# Altium schematic sheet PowerToDes_D34.SchDoc
size 381 x 241 mm; SheetNumber: 4; SheetTotal: 4
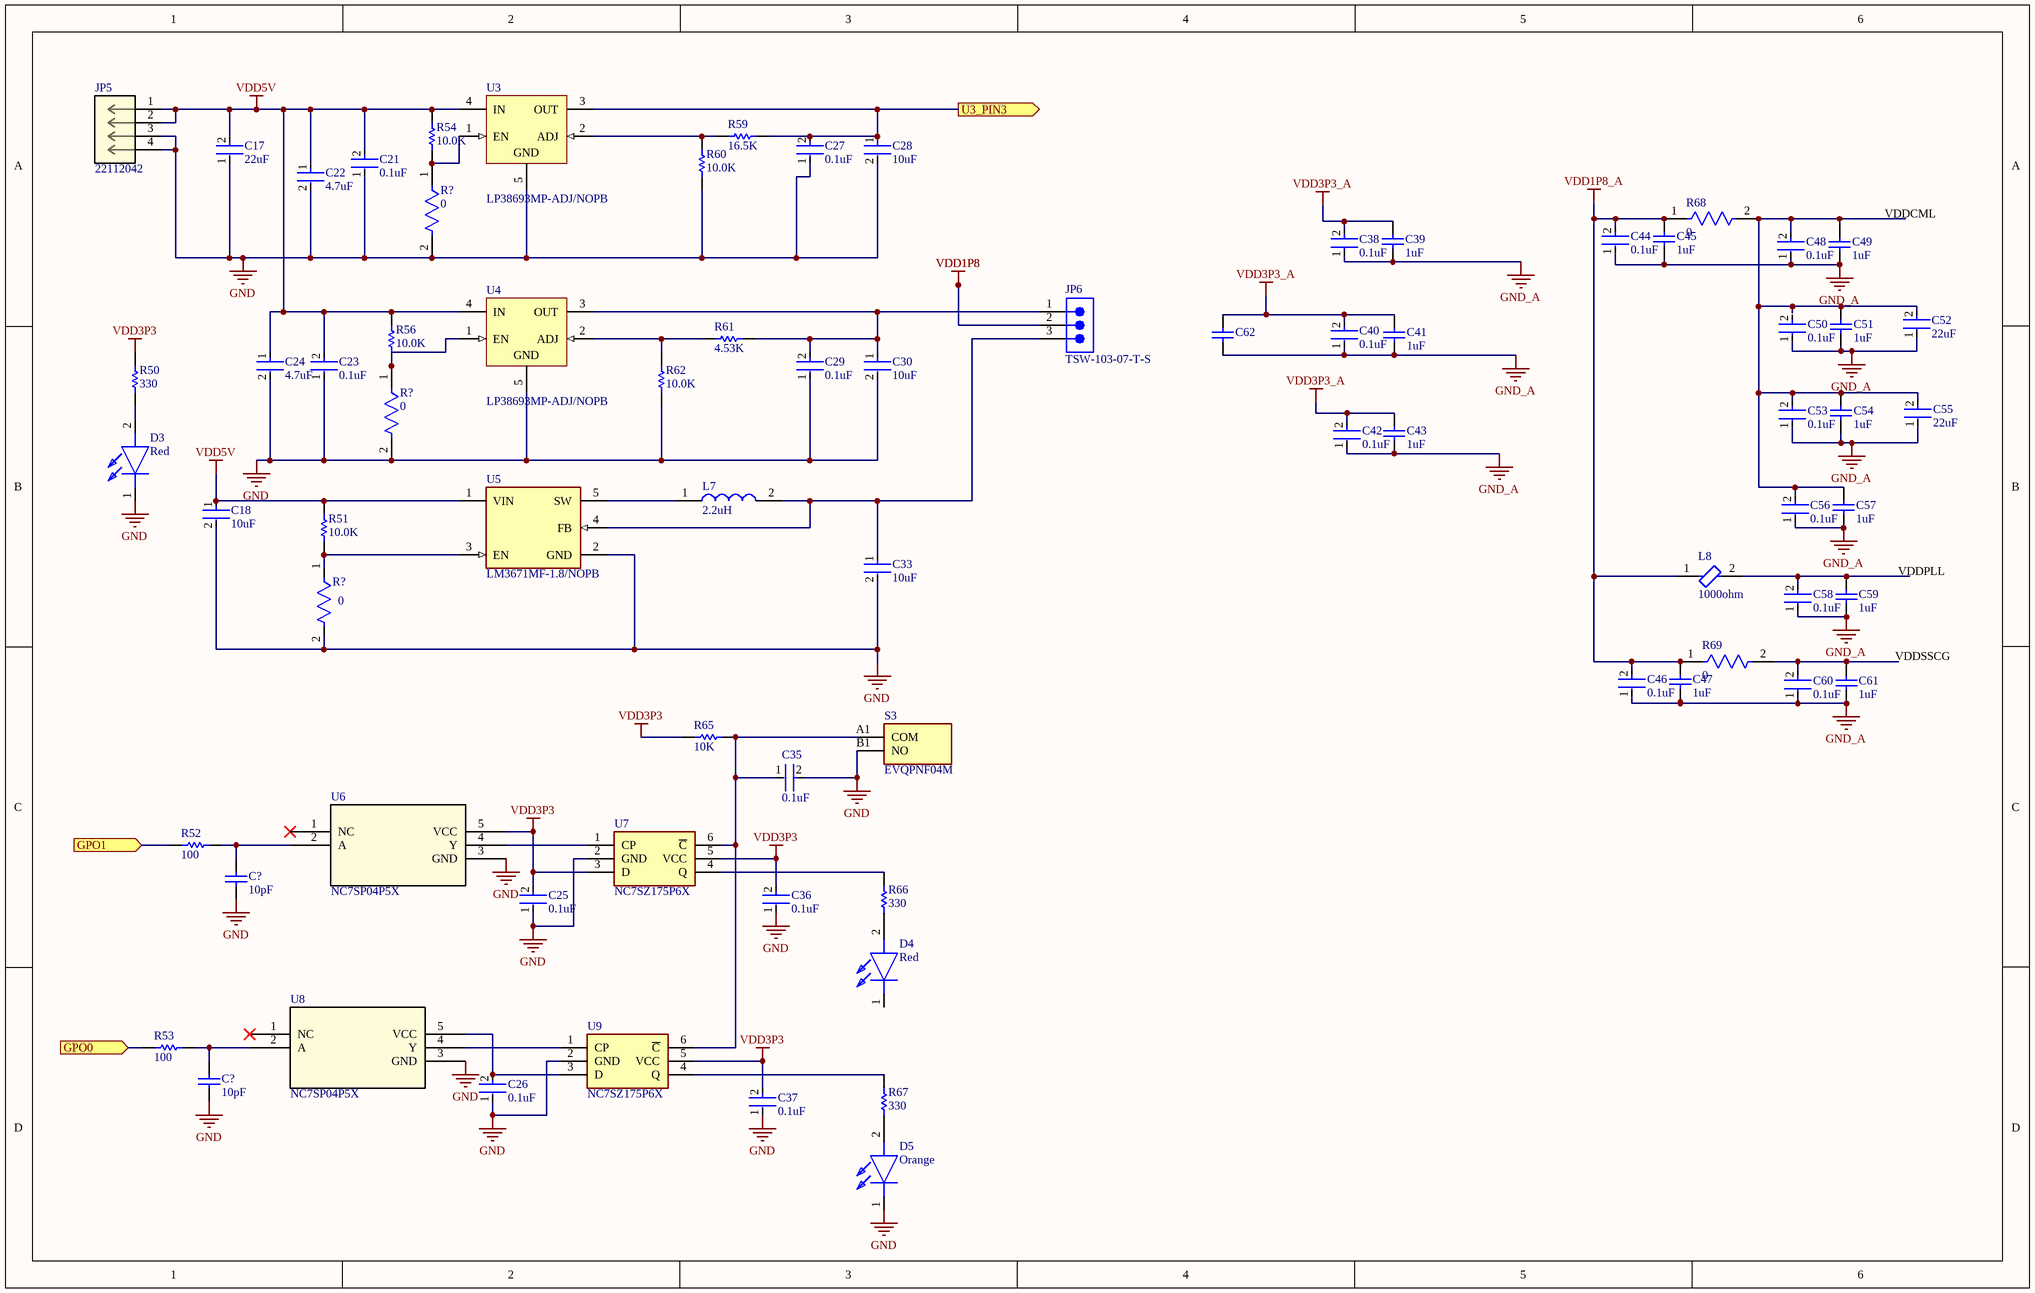
[diagram p0: PowerToDes_D34.SchDoc]

## Parts
(Parts that share a designator on the sheet are numbered #1, #2 ... from top to bottom, then left to right.)
C17  22uF  [FP-GCM32E-0_3-IPC_B]
C18  10uF  [FP-GRM21B-0_1-IPC_C]
C21  0.1uF  [FP-GRM15-MFG]
C22  4.7uF  [FP-GRM21B-0_15-MFG]
C23  0.1uF  [FP-GRM15-MFG]
C24  4.7uF  [FP-GRM21B-0_15-MFG]
C25  0.1uF  [FP-GRM15-MFG]
C26  0.1uF  [FP-GRM15-MFG]
C27  0.1uF  [FP-GRM15-MFG]
C28  10uF  [FP-GRM21B-0_1-IPC_C]
C29  0.1uF  [FP-GRM15-MFG]
C30  10uF  [FP-GRM21B-0_1-IPC_C]
C33  10uF  [FP-GRM21B-0_1-IPC_C]
C35  0.1uF  [FP-GRM15-MFG]
C36  0.1uF  [FP-GRM15-MFG]
C37  0.1uF  [FP-GRM15-MFG]
C38  0.1uF  [FP-GRM15-MFG]
C39  1uF  [CAPC1608X90X35ML10T15]
C40  0.1uF  [FP-GRM15-MFG]
C41  1uF  [CAPC1608X90X35ML10T15]
C42  0.1uF  [FP-GRM15-MFG]
C43  1uF  [CAPC1608X90X35ML10T15]
C44  0.1uF  [FP-GRM15-MFG]
C45  1uF  [CAPC1608X90X35ML10T15]
C46  0.1uF  [FP-GRM15-MFG]
C47  1uF  [CAPC1608X90X35ML10T15]
C48  0.1uF  [FP-GRM15-MFG]
C49  1uF  [CAPC1608X90X35ML10T15]
C50  0.1uF  [FP-GRM15-MFG]
C51  1uF  [CAPC1608X90X35ML10T15]
C52  22uF  [FP-GCM32E-0_3-IPC_B]
C53  0.1uF  [FP-GRM15-MFG]
C54  1uF  [CAPC1608X90X35ML10T15]
C55  22uF  [FP-GCM32E-0_3-IPC_B]
C56  0.1uF  [FP-GRM15-MFG]
C57  1uF  [CAPC1608X90X35ML10T15]
C58  0.1uF  [FP-GRM15-MFG]
C59  1uF  [CAPC1608X90X35ML10T15]
C60  0.1uF  [FP-GRM15-MFG]
C61  1uF  [CAPC1608X90X35ML10T15]
C62  (no value)  [CAPC2013X140X45NL15T25]
C?#1  10pF  [CAPC1005X55X25LL05T10]
C?#2  10pF  [CAPC1005X55X25LL05T10]
D3  Red  [LEDC1608X55N]
D4  Red  [LEDC1608X55N]
D5  Orange  [LEDC1608X55N]
JP5  22112042  [CONN_A-6373-04A_MOL]
JP6  TSW-103-07-T-S  [SMTC-TSW-103-07-X-S]
L7  2.2uH  [LPS3015]
L8  1000ohm  [FP-BLM18-0_15-t0_8-MFG]
R50  330  [RESC1005X40X25ML05T05]
R51  10.0K  [RESC1609X55X30LL15T15]
R52  100  [RESC1005X40X25LL05T05]
R53  100  [RESC1005X40X25LL05T05]
R54  10.0K  [RESC1609X55X30LL15T15]
R56  10.0K  [RESC1609X55X30LL15T15]
R59  16.5K  [RESC1608X55X30LL15T15]
R60  10.0K  [RESC1609X55X30LL15T15]
R61  4.53K  [RESC1608X55X30ML15T15]
R62  10.0K  [RESC1609X55X30LL15T15]
R65  10K  [RESC1005X40X25ML05T05]
R66  330  [RESC1005X40X25ML05T05]
R67  330  [RESC1005X40X25ML05T05]
R68  0  [FP-ERJ-3GEY0R00V-MFG]
R69  0  [FP-ERJ-3GEY0R00V-MFG]
R?#1  0  [FP-ERJ-3GEY0R00V-MFG]
R?#2  0  [FP-ERJ-3GEY0R00V-MFG]
R?#3  0  [FP-ERJ-3GEY0R00V-MFG]
S3  EVQPNF04M  [EVQ5PN05K]
U3  LP38693MP-ADJ/NOPB  [NDC0005A_N]
U4  LP38693MP-ADJ/NOPB  [NDC0005A_N]
U5  LM3671MF-1.8/NOPB  [FP-DBV0005A-IPC_A]
U6  NC7SP04P5X  [SC-88A-5_1P35X2P2_ONS]
U7  NC7SZ175P6X  [SOT65P210X110-6N]
U8  NC7SP04P5X  [SC-88A-5_1P35X2P2_ONS]
U9  NC7SZ175P6X  [SOT65P210X110-6N]

## Ports
GPO0 (in, see PowerToSer[2C]), GPO1 (in, see PowerToSer[3B]), U3_PIN3 (out, see BuckRegulatorOnSer[5C], PowerToSer[2A])

## Nets
GND: C17.1 C18.2 C21.1 C22.2 C23.1 C24.2 C25.1 C26.1 C27.1 C28.2 C29.1 C30.2 C33.2 C35.2 C36.1 C37.1 C?#1.2 C?#2.2 D3.1(K) D5.1(K) JP5.3 JP5.4 R60.2 R62.2 R?#1.2 R?#2.2 R?#3.2 S3.B1(NO) U3.5(GND) U4.5(GND) U5.2(GND) U6.3(GND) U7.2(GND) U8.3(GND) U9.2(GND)
GND_A: C38.1 C39.2 C40.1 C41.2 C42.1 C43.2 C44.1 C45.2 C46.1 C47.2 C48.1 C49.2 C50.1 C51.2 C52.1 C53.1 C54.2 C55.1 C56.1 C57.2 C58.1 C59.2 C60.1 C61.2 C62.2
VDD1P8: JP6.2
VDD1P8_A: C44.2 C45.1 C46.2 C47.1 L8.1 R68.1 R69.1
VDD3P3: C25.2 C36.2 C37.2 R50.1 R65.1 U6.5(VCC) U7.3(D) U7.5(VCC) U9.5(VCC)
VDD3P3_A: C38.2 C39.1 C40.2 C41.1 C42.2 C43.1 C62.1
VDD5V: C17.2 C18.1 C21.2 C22.1 C23.2 C24.1 JP5.1 JP5.2 R51.1 R54.1 R56.1 U3.4(IN) U4.4(IN) U5.1(VIN)
GPO0: R53.1 ; port GPO0
GPO1: R52.1 ; port GPO1
U3_PIN3: C27.2 C28.1 R59.2 U3.3(OUT) ; port U3_PIN3
NetC26_2: C26.2 U8.5(VCC) U9.3(D)
NetC29_2: C29.2 C30.1 JP6.1 R61.2 U4.3(OUT)
NetC33_1: C33.1 JP6.3 L7.2 U5.4(FB)
NetC35_1: C35.1 R65.2 S3.A1(COM) U7.6(~{C}) U9.6(~{C})
NetC48_2: C48.2 C49.1 C51.1 C52.2 C53.2 C54.1 C55.2 C56.2 C57.1 R68.2
NetC58_2: C58.2 C59.1 L8.2
NetC60_2: C60.2 C61.1 R69.2
NetC?#1_1: C?#1.1 R52.2 U6.2(A)
NetC?#2_1: C?#2.1 R53.2 U8.2(A)
NetD3_2: D3.2(A) R50.2
NetD4_2: D4.2(A) R66.2
NetD5_2: D5.2(A) R67.2
NetL7_1: L7.1 U5.5(SW)
NetR51_2: R51.2 R?#3.1 U5.3(EN)
NetR54_2: R54.2 R?#1.1 U3.1(EN)
NetR56_2: R56.2 R?#2.1 U4.1(EN)
NetR59_1: R59.1 R60.1 U3.2(ADJ)
NetR61_1: R61.1 R62.1 U4.2(ADJ)
NetR66_1: R66.1 U7.4(Q)
NetR67_1: R67.1 U9.4(Q)
NetU6_4: U6.4(Y) U7.1(CP)
NetU8_4: U8.4(Y) U9.1(CP)

Not connected (* = marked no-connect by the designer): C50 2; D4 1(K); U6 1(NC)*; U8 1(NC)*

## Notes on the sheet
- (near C49) VDDCML
- VDDPLL
- VDDSSCG

## Library data of the parts
C17 C52 C55 = CMP-06035-049658-1: Ceramic Capacitor for Automotive 22uF ±10% 16VDC X7R 1210 Embossed T/R; Voltage Rating: 16V; Max Operating Temperature: 125°C; Case/Package: 1210; Packaging: Tape and Reel; Termination: SMD/SMT; Height: 2.5mm; Voltage Rating (DC): 16V; Length: 3.2mm; Width: 0.098inch; Voltage: 16V; Depth: 2.5mm; Package Quantity: 1; Mount: Surface Mount; Min Operating Temperature: -55°C; Case Code (Metric): 3225; Case Code (Imperial): 1210; Radiation Hardening: No; Thickness: 0.106inch; Ratings: AEC-Q200; Capacitance: 22uF; Tolerance: 10%; Dielectric: X7R; Lead Free: Lead Free
C18 C28 C30 C33 = CMP-2007-03453-2: Chip Multilayer Ceramic Capacitors for General Purpose, 0805, 10uF, X5R, 15%, 10%, 16V; Radiation Hardening: No; Thickness: 0.053inch; Voltage Rating (DC): 16V; Lead Free: Lead Free; Package Quantity: 1; Width: 1.25mm; Case Code (Imperial): 0805; Depth: 1.25mm; Packaging: Tape and Reel; Dielectric: X5R; Max Operating Temperature: 85°C; Tolerance: 10%; Voltage Rating: 16V; Voltage: 16V; Capacitance: 10uF; Height: 1.25mm; Case Code (Metric): 2012; Material: Ceramic; Mount: Surface Mount; Case/Package: 0805; REACH SVHC: No SVHC; Length: 2mm; Min Operating Temperature: -55°C; Termination: SMD/SMT
C21 C23 C27 C29 = CMP-2100-03641-2: CAP CER 0.1UF 16V X7R 0402; Manufacturer Part Number: GRM155R71C104KA88D; Manufacturer: Murata; Standoff Height: 0mm; Tolerance: 10%; Voltage Rating: 16Vdc; Material: Ceramic; Capacitance: 0.10μF; Value: 0.10μF; RoHS: TRUE; Temperature Characteristic: X7R; Octopart: https://octopart.com/grm155r71c104ka88d-murata-196880; Digikey Description: CAP CER 0.1UF 16V X7R 0402; Device Class L3: Ceramic Capacitors; Height: 0.55mm; ComponentLink2Description: Datasheet; Temperature Range Low: -55°C; Ipc Land Pattern Name: CAPC10050X219; ComponentLink2URL: https://search.murata.co.jp/Ceramy/image/img/A01X/G101/ENG/GRM155R71H471KA01-01A.pdf; Device Class L1: Passive Components; Lead Free: yes; Category: Cap; Package: GRM15; Temperature: -55°C to +125°C; Device Class L2: Capacitors; Temperature Range High: +125°C; Mouser Description: 0402 0.1 uF 16V ±10 % Tolerance X7R SMT Multilayer Ceramic Capacitor
C22 C24 = CMP-2007-03401-2: CAP CER 4.7UF 16V X7R 0805; Material: Ceramic; Tolerance: 10%; Case Code (Metric): 2012; Voltage Rating: 16V; RoHS Compliant: Yes; Voltage Rating (DC): 16V; Case/Package: 0805; Number of Pins: 2; Thickness: 0.053inch; Voltage: 16V; Mount: Surface Mount; Packaging: Tape and Reel; Lead Free: Lead Free; Case Code (Imperial): 0805; Series: GRM; Width: 0.049inch; Package Quantity: 1; Construction: Flat; Min Operating Temperature: -55°C; Termination: SMD/SMT; Max Operating Temperature: 125°C; Length: 2mm; Dielectric: X7R; Depth: 1.25mm; REACH SVHC: No SVHC; Height: 1.25mm; Capacitance: 4.7uF
C25 C26 C35-C38 C40 C42 C44 C46 C48 C50 C53 C56 C58 C60 = CMP-2100-03641-2: CAP CER 0.1UF 16V X7R 0402; Manufacturer Part Number: GRM155R71C104KA88D; Manufacturer: Murata; Standoff Height: 0mm; Tolerance: 10%; Description: CAP Ceramic 0.10μF 10% X7R 16Vdc 0402 SMD; Voltage Rating: 16Vdc; Material: Ceramic; Capacitance: 0.10μF; Value: 0.10μF; RoHS: TRUE; Temperature Characteristic: X7R; Octopart: https://octopart.com/grm155r71c104ka88d-murata-196880; Digikey Description: CAP CER 0.1UF 16V X7R 0402; Device Class L3: Ceramic Capacitors; Height: 0.55mm; ComponentLink2Description: Datasheet; Temperature Range Low: -55°C; Ipc Land Pattern Name: CAPC10050X219; ComponentLink2URL: https://search.murata.co.jp/Ceramy/image/img/A01X/G101/ENG/GRM155R71H471KA01-01A.pdf; Device Class L1: Passive Components; Lead Free: yes; Category: Cap; Package: GRM15; Temperature: -55°C to +125°C; Device Class L2: Capacitors; Temperature Range High: +125°C; Mouser Description: 0402 0.1 uF 16V ±10 % Tolerance X7R SMT Multilayer Ceramic Capacitor
C39 C41 C43 C45 C47 C49 C51 C54 C57 C59 C61 = CMP-2006-02460-1: Manufacturer: Murata; Part Number: GRM188R71E105KA12D
C62 = CMP-2007-03395-1: Part Number: GRM21BR71A106KE51L; Manufacturer: Murata
C?#1 C?#2 = CMP-2008-04245-1: Part Number: GRM1555C1H100JA01D; Manufacturer: Murata
D3 D4 = LTST-C191KRKT: LED; Manufacturer_Name: Lite-On; Datasheet Link: http://www.mouser.com/ds/2/239/S_110_LTST-C191KRKT-539838.pdf; Height: 0.55mm; Manufacturer_Part_Number: LTST-C191KRKT; Mouser Part Number: 859-LTST-C191KRKT; Mouser Price/Stock: https://www.mouser.co.uk/ProductDetail/LITEON/LTST-C191KRKT?qs=BAIUz4Y8PJBLfOhzue0q%252BA%3D%3D; Arrow Part Number: LTST-C191KRKT; Arrow Price/Stock: https://www.arrow.com/en/products/ltst-c191krkt/lite-on-technology?utm_currency=USD&region=nac
D5 = LTST-C191KFKT: LED; Manufacturer_Name: Lite-On; Datasheet Link: https://datasheet.datasheetarchive.com/originals/distributors/Datasheets-305/79307.pdf; Height: 0.55mm; Manufacturer_Part_Number: LTST-C191KFKT; Mouser Part Number: 859-LTST-C191KFKT; Mouser Price/Stock: https://www.mouser.co.uk/ProductDetail/Lite-On/LTST-C191KFKT?qs=1bx9pL%2Fk%252BiAv01YAc0eitQ%3D%3D; Arrow Part Number: LTST-C191KFKT; Arrow Price/Stock: https://www.arrow.com/en/products/ltst-c191kfkt/lite-on-technology?utm_currency=USD&region=europe
JP5 = 22112042: KK 254 Solid Header, Vertical, with Friction Lock, 4 Circuits, Gold (Au)  Plating, Bag; Manufacturer_Name: Molex Connector Corporation; Copyright: Copyright (C) 2025 Ultra Librarian. All rights reserved.; Manufacturer_Part_Number: 22112042; RefDes: RefDes; Type: Type
JP6 = CMP-1024-00332-1: 0.025" SQ Post Header, Through-hole, Vertical, -55 to 105 degC, 2.54 mm Pitch, 3-Pin, Male, RoHS; Manufacturer: Samtec; Pitch: 2.54 mm; ComponentLink1URL: http://www.samtec.com; ComponentLink3URL: http://www.samtec.com/documents/webfiles/cpdf/TSW-XXX-XX-XXX-X-XX-XXX-MKT.pdf; PartNumber: TSW-103-07-T-S; Mounting Technology: Through-hole; RoHS: True; DatasheetVersion: F-214; PackageVersion: DM, 8/1988; Temperature Range: -55 to 105 degC; ComponentLink2Description: Datasheet; ComponentLink1Description: Manufacturer URL; Orientation: Vertical; PackageReference: TSW-103-07-X-S; ComponentLink3Description: Package Specification; ComponentLink2URL: http://www.samtec.com/documents/webfiles/pdf/TSW_TH.PDF; PackageDescription: .025[0.64] SQ. Post Terminal Strip Assembly
L7 = LPS3015-222MLB: Inductor; Manufacturer_Name: COILCRAFT; Datasheet Link: https://www.mouser.de/datasheet/2/597/lps3015-270734.pdf; Manufacturer_Part_Number: LPS3015-222MLB; Mouser Part Number: 994-LPS3015-222MLB; Mouser Price/Stock: https://www.mouser.co.uk/ProductDetail/Coilcraft/LPS3015-222MLB?qs=zCSbvcPd3pZ6eDikEPAG6g%3D%3D
L8 = CMP-0686-00457-3: Chip Ferrite Bead, 0603, 1000Ω @ 100MHz, 0.5Ω, 25%, 450mA; Number of Circuits: 1; Max DC Current: 400mA; Shielding: Unshielded; DC Resistance (DCR): 500mR; Material: Steel; DC Resistance-Max: 700mR; Impedance: 1kR; Case Code (Imperial): 0603; Max Current Rating: 400mA; Frequency: 100MHz; Min Operating Temperature: -55°C; Case/Package: 0603; Depth: 0.8mm; Lead Free: Lead Free; Core Material: Ferrite; Current Rating: 400mA; Resistance: 500mR; Case Code (Metric): 1608; DC Current: 400mA; Package Quantity: 1; Packaging: Tape and Reel; Width: 0.8mm; Military Standard: Not; Height: 0.8mm; Series: BLM18A; Max Operating Temperature: 125°C; Tolerance: 25%; Termination: SMD/SMT; Test Frequency: 100MHz; Number of Lines: 1; Number of Pins: 2; REACH SVHC: No SVHC; Length: 1.6mm; Radiation Hardening: No
R50 R66 R67 = CMP-2002-01143-1: Manufacturer: Panasonic; Part Number: ERJ2RKF3300X
R51 R54 R56 R60 R62 = CMP-1012-00623-3: Chip Resistor, 10 KOhm, +/- 1%, 0.1 W, -55 to 155 degC, 0603 (1608 Metric), RoHS, Tape and Reel; Manufacturer: Panasonic; Voltage Rating: 75V; Case\/Package: 0603; Power Rating: 100mW; Resistance: 10KOhm; Temperature Coefficient: 100ppm\/degreesC; Number of Pins: 2; Package Reference: 603; Depth: 0.8mm; Mount: SurfaceMount; Package Description: 2-Pin Surface Mount Device, Body 1.6 x 0.85 mm; Datasheet Version: 02/2017; Length: 1.6mm; Lead Free: LeadFree; Height: 0.45mm; Number of Terminations: 2; Max Power Dissipation: 100mW; Min Operating Temperature: -55degC; Datasheet URL: https://industrial.panasonic.com/cdbs/www-data/pdf/RDA0000/AOA0000C304.pdf; Termination: SMD/SMT; Case Code (Metric): 1608; Case Code (Imperial): 0603; Tolerance: 1%; Max Operating Temperature: 155degC; RoHSCompliant: true; Voltage Rating (DC): 75V; Radiation Hardening: No; Packaging: TapeandReel; Composition: ThickFilm; Mounting Technology: SurfaceMount; Manufacturer URL: http://www.panasonic.com/; Width: 0.031inch; REACH SVHC: NoSVHC; Contact Plating: Tin; Military Standard: Not; Package Quantity: 1
R52 R53 = CMP-2002-00605-3: Chip Resistor, 100 Ohm, +/- 1%, 100 mW, -55 to 155 degC, 0402 (1005 Metric), RoHS, Tape and Reel; Manufacturer: Basic Passives; PartNumber: ERJ-2RKF1000X; Power Rating: 100 mW; Resistance: 100 Ohm; Voltage Rating: 50 V; Case\/Package: 0402; Width: 0.5 mm; Pins: 2; ComponentLink2Description: Datasheet; PackageReference: 0402; Height: 0.35 mm; Tolerance: 1%; DatasheetVersion: 04/2015; Case Code (Imperial): 0402; Min Operating Temperature: -55 degC; Radiation Hardening: No; Length: 1 mm; Package Quantity: 10000; PackageDescription: 2-Pin Surface Mount Device, Body 1 x 0.5 mm; Mounting Technology: Surface Mount; Case Code (Metric): 1005; Packaging: Tape and Reel; ComponentLink1URL: http://www.panasonic.com/; RoHSCompliant: true; Max Operating Temperature: 155 degC; REACH SVHC: Yes; ComponentLink1Description: Manufacturer URL; ComponentLink2URL: http://industrial.panasonic.com/cdbs/www-data/pdf/RDA0000/AOA0000C86.pdf; Mount: Surface Mount
R59 = CMP-2000-00279-1: Manufacturer: Panasonic; Part Number: ERJ-3EKF1652V
R61 = CMP-2000-00512-1: Part Number: ERJ-3EKF4531V; Manufacturer: Panasonic
R65 = CMP-2002-00433-1: Part Number: ERJ-2GEJ103X; Manufacturer: Panasonic
R68 R69 = CMP-2000-00700-2: RES SMD 0 OHM JUMPER 1/10W 0603; Manufacturer Part Number: ERJ-3GEY0R00V; Manufacturer: Panasonic; Tolerance: 5%; Description: 0 Ohms Jumper 0.1W, 1/10W Chip Resistor 0603 (1608 Metric) Automotive AEC-Q200 Thick Film; Automotive Grade: Grade 0; Voltage Rating: 75V; Value: 0Ω; Temperature Coefficient: -100/+600ppm/°C; Power Rating: 0.1W; Mouser Description: Resistor, Chip Thick Film, 0 Ohm, 0.1w, Resistor, Chip Thick Film, 0 Ohm, 0.1w, 5%; Ipc Land Pattern Name: RESC16080X45; Category: Res; Package: 0603; Temperature: -55°C to +155°C; Temperature Range Low: -55°C; Series: ERJ; Resistance: 0Ω; RoHS: TRUE; Composition: Thick Film; Octopart: https://octopart.com/erj-3gey0r00v-panasonic-55389238; Device Class L1: Passive Components; Footprint Url: https://industrial.panasonic.com/cdbs/www-data/pdf/RDA0000/DMA0000COL17.pdf; ComponentLink2Description: Datasheet; Device Class L2: Resistors; Temperature Range High: +155°C; Digikey Description: RES SMD 0 OHM JUMPER 1/10W 0603; Lead Free: Yes; Device Class L3: Chip SMD Resistors; Height: 0.55mm; ComponentLink2URL: https://industrial.panasonic.com/cdbs/www-data/pdf/RDA0000/AOA0000C301.pdf; Automotive: Yes
R?#1-R?#3 = CMP-2000-00700-2: RES SMD 0 OHM JUMPER 1/10W 0603; Manufacturer Part Number: ERJ-3GEY0R00V; Manufacturer: Panasonic; Tolerance: 5%; Automotive Grade: Grade 0; Voltage Rating: 75V; Value: 0Ω; Temperature Coefficient: -100/+600ppm/°C; Power Rating: 0.1W; Mouser Description: Resistor, Chip Thick Film, 0 Ohm, 0.1w, Resistor, Chip Thick Film, 0 Ohm, 0.1w, 5%; Ipc Land Pattern Name: RESC16080X45; Category: Res; Package: 0603; Temperature: -55°C to +155°C; Temperature Range Low: -55°C; Series: ERJ; Resistance: 0Ω; RoHS: TRUE; Composition: Thick Film; Octopart: https://octopart.com/erj-3gey0r00v-panasonic-55389238; Device Class L1: Passive Components; Footprint Url: https://industrial.panasonic.com/cdbs/www-data/pdf/RDA0000/DMA0000COL17.pdf; ComponentLink2Description: Datasheet; Device Class L2: Resistors; Temperature Range High: +155°C; Digikey Description: RES SMD 0 OHM JUMPER 1/10W 0603; Lead Free: Yes; Device Class L3: Chip SMD Resistors; Height: 0.55mm; ComponentLink2URL: https://industrial.panasonic.com/cdbs/www-data/pdf/RDA0000/AOA0000C301.pdf; Automotive: Yes
S3 = EVQPNF04M: Switch; Manufacturer_Name: Panasonic; Datasheet Link: https://industrial.panasonic.com/cdbs/www-data/pdf/ATK0000/ATK0000C376.pdf; Manufacturer_Part_Number: EVQPNF04M
U3 U4 = CMP-0062-01809-4: 500mA Low Dropout CMOS Linear Regulators with Adjustable Output Stable with Ceramic Output Capacitors, 5-pin SOT-223, Pb-Free, 1000 Reel; Manufacturer: Texas Instruments; PackageTopMarking: XYTT*LJUB; CompType: LDO IC; PowerWise: Y; PackageReference: NDC0005A; ComponentLink1Description: Datasheet URL; RoHS: Y; PackageDescription: Moldec SOT-223, 6.50 x 3.56 x 1.6mm Body, 5 Lead, 1.5mm Pitch; ComponentLink1URL: http://www.ti.com/general/docs/lit/getliterature.tsp?genericPartNumber=LP38693-ADJ&fileType=pdf; PartNumber: LP38693MP-ADJ/NOPB; High-Reliability: Y; Code_JEDEC: TO-261-AB; Code_IPC: SOT223-5; PinCount: 5
U5 = CMP-0063-00882-4: IC REG BUCK 1.8V 600MA SOT23-5; Efficiency: 93%; Switching Frequency: 2.6MHz; Max Supply Voltage: 5.5V; Frequency: 2MHz; Output Type: Fixed; Min Output Voltage: 1.1V; Min Input Voltage: 2.7V; Synchronous Rectifier: Yes; Quiescent Current: 16uA; Number of Outputs: 1; Contact Plating: Tin; Max Output Voltage: 1.8V; Output Voltage: 1.8V; Termination: SMD/SMT; Mount: Surface Mount; Series: LM3671; Length: 2.92mm; Case/Package: SOT-23; Max Operating Temperature: 85°C; Nominal Output Voltage: 1.8V; Radiation Hardening: No; Package Quantity: 1000; Width: 1.6mm; REACH SVHC: No SVHC; Height: 1.02mm; Max Input Voltage: 5.5V; Lead Free: Lead Free; Output Current: 600mA; Packaging: Tape and Reel; Number of Pins: 5; RoHS Compliant: Yes; Min Operating Temperature: -40°C; Max Output Current: 600mA; Min Supply Voltage: 2.7V
U6 U8 = NC7SP04P5X: No Description Available; Manufacturer_Name: onsemi / Fairchild Semiconductor; Copyright: Copyright (C) 2025 Ultra Librarian. All rights reserved.; Manufacturer_Part_Number: NC7SP04P5X; RefDes: RefDes; Type: Type
U7 U9 = NC7SZ175P6X: Integrated Circuit; Manufacturer_Name: onsemi; Datasheet Link: https://www.onsemi.com/pub/Collateral/NC7SZ175-D.PDF; Height: 1.1mm; Manufacturer_Part_Number: NC7SZ175P6X; Mouser Part Number: 512-NC7SZ175P6X; Mouser Price/Stock: https://www.mouser.co.uk/ProductDetail/ON-Semiconductor-Fairchild/NC7SZ175P6X?qs=HTrs02CcwqVmXJtpHt%2FvXg%3D%3D; Arrow Part Number: NC7SZ175P6X; Arrow Price/Stock: https://www.arrow.com/en/products/nc7sz175p6x/on-semiconductor?region=nac